# Altium schematic sheet POWER.SchDoc
size A4; Organization: Altium Limited; Address1: L3, 12a Rodborough Rd; Address2: Frenchs Forest; Address3: NSW; Address4: Australia 2086
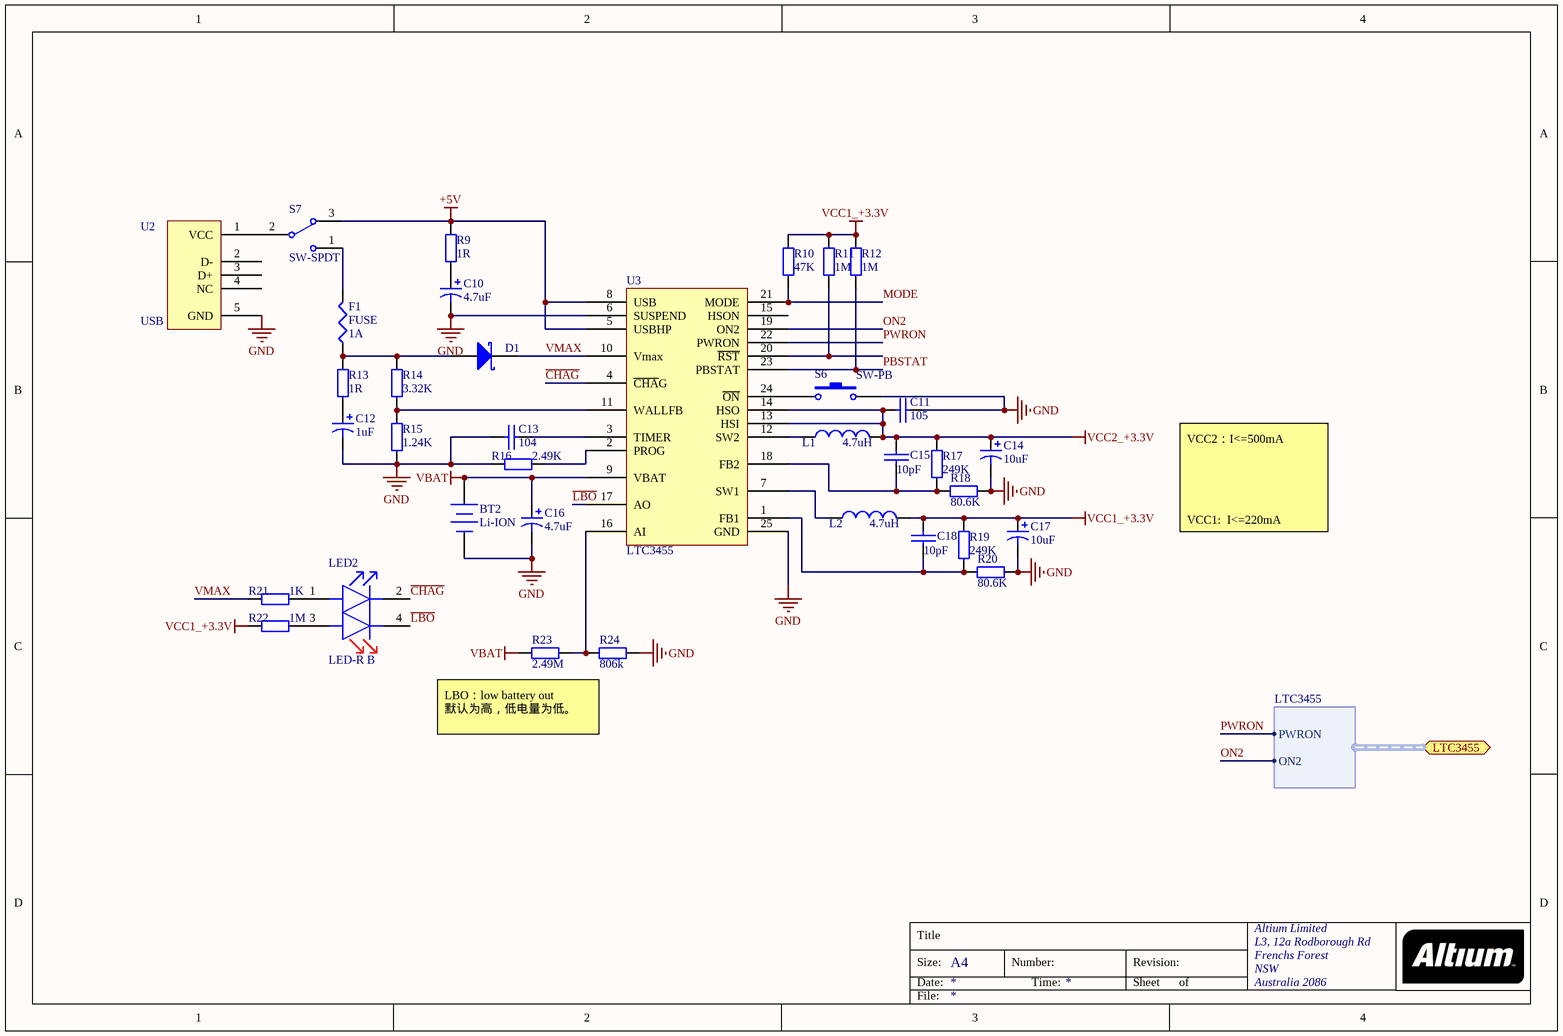
[diagram p0: POWER.SchDoc]

## Parts
BT2  Li-ION  [BAT-2]
C10  value 4.7uF  [SMA-C]  (hidden comment: Cap Pol1)
C11  105  [C0805]
C12  value 1uF  [C0805]  (hidden comment: Cap Pol1)
C13  104  [C0805]
C14  value 10uF  [SMA-C]  (hidden comment: Cap Pol1)
C15  10pF  [C0805]
C16  value 4.7uF  [SMA-C]  (hidden comment: Cap Pol1)
C17  value 10uF  [SMA-C]  (hidden comment: Cap Pol1)
C18  10pF  [C0805]
D1  MBR120  [DO-214AB]  (value not drawn)
F1  FUSE  value 1A  [R1812]
L1  value 4.7uH  [L-5X4mm-S]  (hidden comment: Inductor)
L2  value 4.7uH  [L-5X4mm-S]  (hidden comment: Inductor)
LED2  LED-R B  [0805LED - r b]
R9  value 1R  [R0805]  (hidden comment: Res2)
R10  value 47K  [R0805]  (hidden comment: Res2)
R11  value 1M  [R0805]  (hidden comment: Res2)
R12  value 1M  [R0805]  (hidden comment: Res2)
R13  value 1R  [R0805]  (hidden comment: Res2)
R14  value 3.32K  [R0805]  (hidden comment: Res2)
R15  value 1.24K  [R0805]  (hidden comment: Res2)
R16  value 2.49K  [R0805]  (hidden comment: Res2)
R17  value 249K  [R0805]  (hidden comment: Res2)
R18  value 80.6K  [R0805]  (hidden comment: Res2)
R19  value 249K  [R0805]  (hidden comment: Res2)
R20  value 80.6K  [R0805]  (hidden comment: Res2)
R21  value 1K  [R0805]  (hidden comment: Res2)
R22  value 1M  [R0805]  (hidden comment: Res2)
R23  value 2.49M  [R0805]  (hidden comment: Res2)
R24  value 806k  [R0805]  (hidden comment: Res2)
S6  SW-PB  [SW-SMD1]
S7  SW-SPDT  [HDR1X3]
U2  USB  [USB-mini]
U3  LTC3455  [QFN-24]

## Ports
LTC3455 (harness LTC3455)

## Harnesses
LTC3455: PWRON, ON2

## Nets
+5V: R9.2 S7.3 U3.5(USBHP) U3.8(USB)
GND: BT2.2(-) C10.2 C11.1 C12.2 C13.2 C14.2 C16.2 C17.2 R15.2 R16.1 R18.1 R20.1 R24.1 S6.2 U2.5(GND) U3.6(SUSPEND) U3.25(GND)
VBAT: BT2.1(+) C16.1 R23.2 U3.9(VBAT)
VCC1_+3.3V: C17.1 C18.1 L2.2 R10.2 R11.2 R12.2 R19.2 R22.1
VCC2_+3.3V: C11.2 C14.1 C15.1 L1.2 R17.2 U3.13(HSI) U3.14(HSO)
~{CHAG}: LED2.2 U3.4(~{CHA}G)
~{LBO}: LED2.4 U3.17(AO)
MODE: R10.1 U3.21(MODE)
ON2: U3.19(ON2) ; port LTC3455.ON2
PBSTAT: R12.1 U3.23(PBSTAT)
PWRON: U3.22(PWRON) ; port LTC3455.PWRON
VMAX: D1.2(K) R21.2 U3.10(Vmax)
NetC10_1: C10.1 R9.1
NetC12_1: C12.1 R13.1
NetC13_1: C13.1 U3.3(TIMER)
NetC15_2: C15.2 R17.1 R18.2 U3.18(FB2)
NetC18_2: C18.2 R19.1 R20.2 U3.1(FB1)
NetD1_1: D1.1(A) F1.1 R13.2 R14.2
NetF1_2: F1.2 S7.1
NetL1_1: L1.1 U3.12(SW2)
NetL2_1: L2.1 U3.7(SW1)
NetLED2_1: LED2.1 R21.1
NetLED2_3: LED2.3 R22.2
NetR11_1: R11.1 U3.20(~{RST})
NetR14_1: R14.1 R15.1 U3.11(WALLFB)
NetR16_2: R16.2 U3.2(PROG)
NetR23_1: R23.1 R24.2 U3.16(AI)
NetS6_1: S6.1 U3.24(~{ON})
NetS7_2: S7.2 U2.1(VCC)

Not connected (* = marked no-connect by the designer): U2 2(D-) 3(D+) 4(NC); U3 15(HSON)

## Notes on the sheet
- VCC2：I<=500mA
  VCC1:  I<=220mA
- LBO：low battery out
  默认为高，低电量为低。
- Title
- Size:
- Date:
- A4
- Number:
- Time:
- Revision:
- Sheet
- of
- File:

## Library data of the parts
BT2 = Battery: Multicell Battery; Published: 24-Mar-1999; LatestRevisionDate: 17-Jul-2002; LatestRevisionNote: Re-released for DXP Platform.; PackageReference: BAT-2; Publisher: Altium Limited; PackageDescription: Battery; 2 Leads
C10 C12 C14 C16 C17 = Cap Pol1: Polarized Capacitor (Radial); Published: 8-Jun-2000; LatestRevisionDate: 17-Jul-2002; LatestRevisionNote: Re-released for DXP Platform.; PackageReference: RB7.6-15; Publisher: Altium Limited; PackageDescription: Polarized Capacitor (Radial); 2 Leads
C11 C13 C15 C18 = CAP: Capacitor
D1 = D Schottky: Schottky Diode; Published: 8-Jun-2000; LatestRevisionDate: 17-Jul-2002; LatestRevisionNote: Re-released for DXP Platform.; PackageReference: SMB; Publisher: Altium Limited; PackageDescription: DO-214-AA/SMB; 2 C-Bend Leads; Body 5.3 x 3.6 mm, inc. leads (LxW); Code_JEDEC: DO-214-AA
F1 = Res3: Resistor; Published: 8-Jun-2000; LatestRevisionDate: 29-May-2009; LatestRevisionNote: IPC-7351 Footprint Added.; PackageReference: J1-0603; Publisher: Altium Limited; PackageDescription: Chip Resistor
L1 L2 = Inductor: Code_IEC: 1005; Published: 8-Jun-2000; LatestRevisionDate: 29-May-2009; LatestRevisionNote: IPC-7351 Footprint Added.; PackageReference: 0402-A; Publisher: Altium Limited; PackageDescription: Chip Inductor; Code_JEITA: 0402
R9-R24 = Res2: Resistor; Published: 8-Jun-2000; LatestRevisionDate: 17-Jul-2002; LatestRevisionNote: Re-released for DXP Platform.; PackageReference: AXIAL-0.4; Publisher: Altium Limited; PackageDescription: Axial Device, Thru-Hole; 2 Leads; 0.4 in Pin Spacing
S6 = SW-PB: Switch; Published: 24-Mar-1999; LatestRevisionDate: 17-Jul-2002; LatestRevisionNote: Re-released for DXP Platform.; PackageReference: SPST-2; Publisher: Altium Limited; PackageDescription: Switch; 2 Leads
S7 = SW-SPDT: SPDT Subminiature Toggle Switch, Right Angle Mounting, Vertical Actuation; Published: 24-Mar-1999; LatestRevisionDate: 17-Dec-2003; LatestRevisionNote: Schematic revised, PCB Footprint replaced.; DatasheetVersion: 05-Dec-2000; PackageReference: TL36WW15050; Publisher: Altium Limited; PackageDescription: Switch; 4 Leads; ComponentLink1Description: Manufacturer Link; ComponentLink1URL: http://www.apem.com
U3 = LTC3455: LI-CELL charger